# EAGLE design Serf_G2553 (EAGLE 6.5.0)
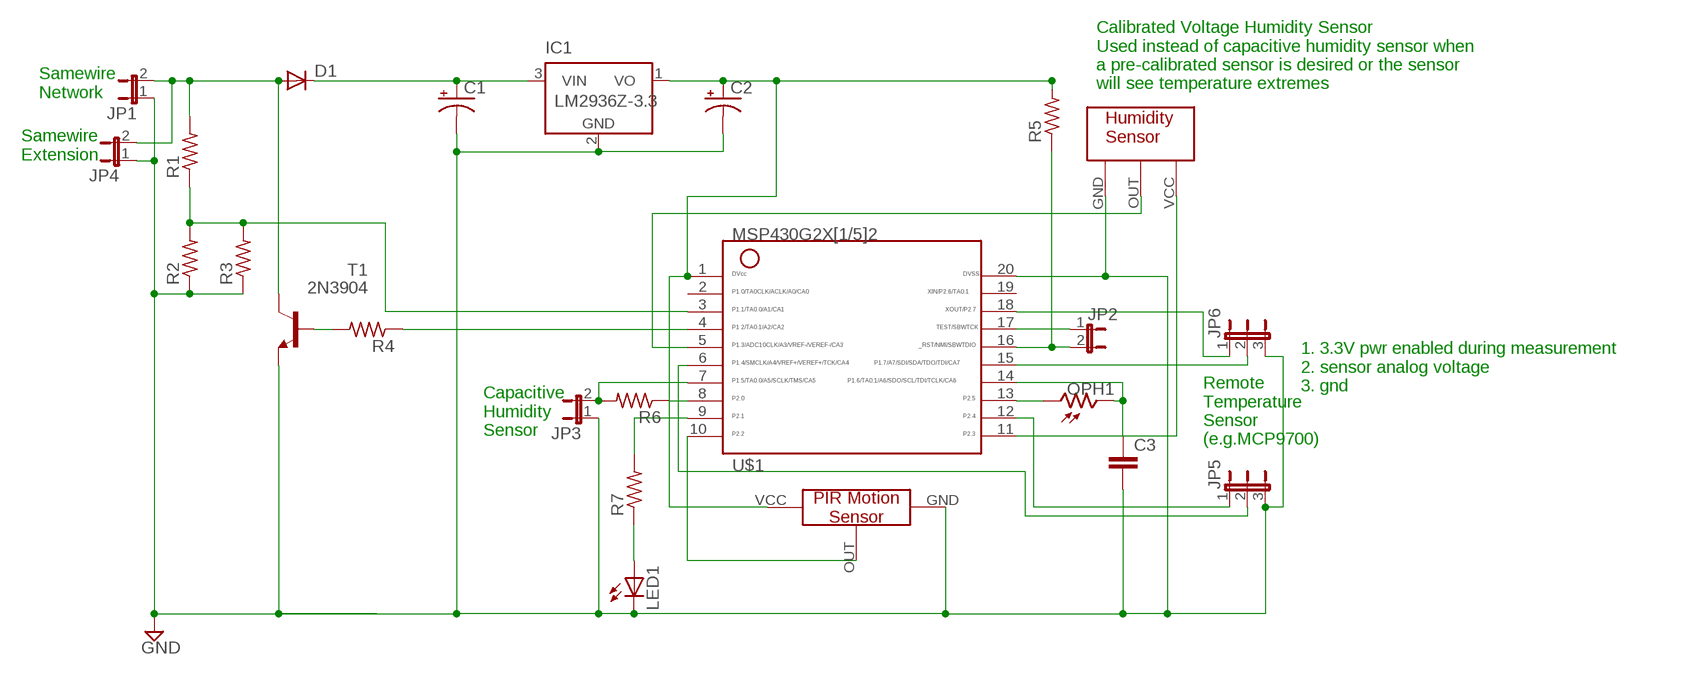
[diagram p0: schematic, sheet 1]

## Parts
C1  CPOL-USE2.5-6  [E2,5-6]
C2  CPOL-USE2.5-6  [E2,5-6]
C3  C7.5/3  [C7.5B3]
D1  1N4148DO35-7  [DO35-7]
IC1  LM2936Z-3.3  [TO92]
JP1  JP1E  [JP1]
JP2  JP1E  [JP1]
JP3  JP1E  [JP1]
JP4  JP1E  [JP1]
JP5  JP2E  [JP2]
JP6  JP2E  [JP2]
LED1  LED3MM  [LED3MM]
OPH1  VT90N1  [VT900]
R1  R-US_0204/2V  [0204V]
R2  R-US_0204/2V  [0204V]
R3  R-US_0204/2V  [0204V]
R4  R-US_0204/2V  [0204V]
R5  R-US_0204/2V  [0204V]
R6  R-US_0204/2V  [0204V]
R7  R-US_0204/2V  [0204V]
T1  2N3904  [TO92]
U$1  G2X[1/5]2---N20  [N20]
U$2  PANASONIC_PIR  [PANASONIC_PIR]
U$3  HIH-5030  [HIH-530]

## Nets
GND: C1.- C2.- C3.2 IC1.2(GND) JP1.1 JP3.1 JP4.1 JP5.3 JP6.3 LED1.K(C) R2.1 R3.1 T1.3(E) U$1.20 U$2.GND U$3.GND
N$1 [Samewire]: D1.A JP1.2 JP4.2 R1.2 T1.1(C)
N$2: OPH1.1 U$1.13
N$3: R4.1 U$1.4
N$4: R1.1 R2.2 R3.2 U$1.3
N$5: C3.1 OPH1.2 U$1.14
N$6: R4.2 T1.2(B)
N$7: R6.1 U$1.8
N$8: LED1.A R7.1
N$9: JP2.1 U$1.17
N$10: R7.2 U$1.9
N$11: JP3.2 R6.2 U$1.7
N$12: U$1.10 U$2.OUT
N$13: C1.+ D1.C IC1.3(VIN)
N$14: C2.+ IC1.1(VO) R5.2 U$1.1 U$2.VCC
N$15: U$1.5 U$3.OUT
N$16: U$1.11 U$3.VCC
N$18: JP5.1 U$1.12
N$19: JP5.2 U$1.6
N$20: JP2.2 R5.1 U$1.16
N$22: JP6.1 U$1.18
N$23: JP6.2 U$1.15
Unconnected: U$1.2 U$1.19

## Notes on the sheet
- Calibrated Voltage Humidity Sensor
  Used instead of capacitive humidity sensor when
  a pre-calibrated sensor is desired or the sensor
  will see temperature extremes
- Samewire
  Network
- Samewire
  Extension
- 1. 3.3V pwr enabled during measurement
  2. sensor analog voltage
  3. gnd
- Capacitive
  Humidity
  Sensor
- Remote
  Temperature
  Sensor
  (e.g.MCP9700)

## Library data of the parts
C1 C2 = rcl:CPOL-US: POLARIZED CAPACITOR, American symbol
C3 = capacitor-wima:C: CAPACITOR naming: grid - package width
D1 = diode:1N4148: DIODE high speed (Philips)
IC1 = national-semiconductor:LM2936?*: Ultra-Low Quiescent Current LDO Voltage Regulator Source: Data sheet <http://www.national.com/ds/LM/LM2936.pdf>; MF: NATIONAL SEMICONDUCTOR; MPN: LM2936Z-3.3/NOPB; OC_FARNELL: 1564641; OC_NEWARK: 41K4532
JP1-JP4 = jumper:JP1E: JUMPER
JP5 JP6 = jumper:JP2E: JUMPER
LED1 = led:LED: LED OSRAM: - CHIPLED LG R971, LG N971, LY N971, LG Q971, LY Q971, LO R971, LY R971 LH N974, LH R974 LS Q976, LO Q976, LY Q976 LO Q996 - Hyper CHIPLED LW Q18S LB Q993, LB Q99A, LB R99A - SideLED LS A670, LO A670, LY A670, LG A670, LP A670 LB A673, LV A673, LT A673, LW A673 LH A674 LY A675 LS A676, LA A676, LO A676, LY A676, LW A676 LS A679, LY A679, LG A679 - Hyper Micro SIDELED® LS Y876, LA Y876, LO Y876, LY Y876 LT Y87S - SmartLED LW L88C, LW L88S LB L89C, LB L89S, LG L890 LS L89K, LO L89K, LY L89K LS L896, LA L896, LO L896, LY L896 - TOPLED LS T670, LO T670, LY T670, LG T670, LP T670 LSG T670, LSP T670, LSY T670, LOP T670, LYG T670 LG T671, LOG T671, LSG T671 LB T673, LV T673, LT T673, LW T673 LH T674 LS T676, LA T676, LO T676, LY T676, LB T676, LH T676, LSB T676, LW T676 LB T67C, LV T67C, LT T67C, LS T67K, LO T67K, LY T67K, LW E67C LS E67B, LA E67B, LO E67B, LY E67B, LB E67C, LV E67C, LT E67C LW T67C LS T679, LY T679, LG T679 LS T770, LO T770, LY T770, LG T770, LP T770 LB T773, LV T773, LT T773, LW T773 LH T774 LS E675, LA E675, LY E675, LS T675 LS T776, LA T776, LO T776, LY T776, LB T776 LHGB T686 LT T68C, LB T68C - Hyper Mini TOPLED® LB M676 - Mini TOPLED Santana® LG M470 LS M47K, LO M47K, LY M47K Source: http://www.osram.convergy.de LUXEON: - LUMILED® LXK2-PW12-R00, LXK2-PW12-S00, LXK2-PW14-U00, LXK2-PW14-V00 LXK2-PM12-R00, LXK2-PM12-S00, LXK2-PM14-U00 LXK2-PE12-Q00, LXK2-PE12-R00, LXK2-PE12-S00, LXK2-PE14-T00, LXK2-PE14-U00 LXK2-PB12-K00, LXK2-PB12-L00, LXK2-PB12-M00, LXK2-PB14-N00, LXK2-PB14-P00, LXK2-PB14-Q00 LXK2-PR12-L00, LXK2-PR12-M00, LXK2-PR14-Q00, LXK2-PR14-R00 LXK2-PD12-Q00, LXK2-PD12-R00, LXK2-PD12-S00 LXK2-PH12-R00, LXK2-PH12-S00 LXK2-PL12-P00, LXK2-PL12-Q00, LXK2-PL12-R00 Source: www.luxeon.com KINGBRIGHT: KA-3528ASYC Source: www.kingbright.com
OPH1 = photo-elements:VT9: Photoconductive Cell VT900 Series Source: http://optoelectronics.perkinelmer.com/content/Datasheets/DTS_vt900seriesdatasheet.pdf
R1-R7 = rcl:R-US_: RESISTOR, American symbol
T1 = transistor:2N3904: NPN TRANSISTOR
U$1 = TI_MSP430_v16:G2X[1/5]2---N20: MSP430G2X[1/5]2 MSP430G2x52, MSP430G2x12 PDIP (N) 20 Pin Package http://focus.ti.com/docs/prod/folders/print/msp430g2452.html
U$2 = Panasonic_PIR:PANASONIC_PIR: Panasonic PIR Motion Sensor (EKMC1603111)
U$3 = honeywell_humidity_hih-5030:HIH-5030: Honeywell Humidity Sensor HIH-5030

## Net classes
1 Samewire: width 0.508 mm

## Board
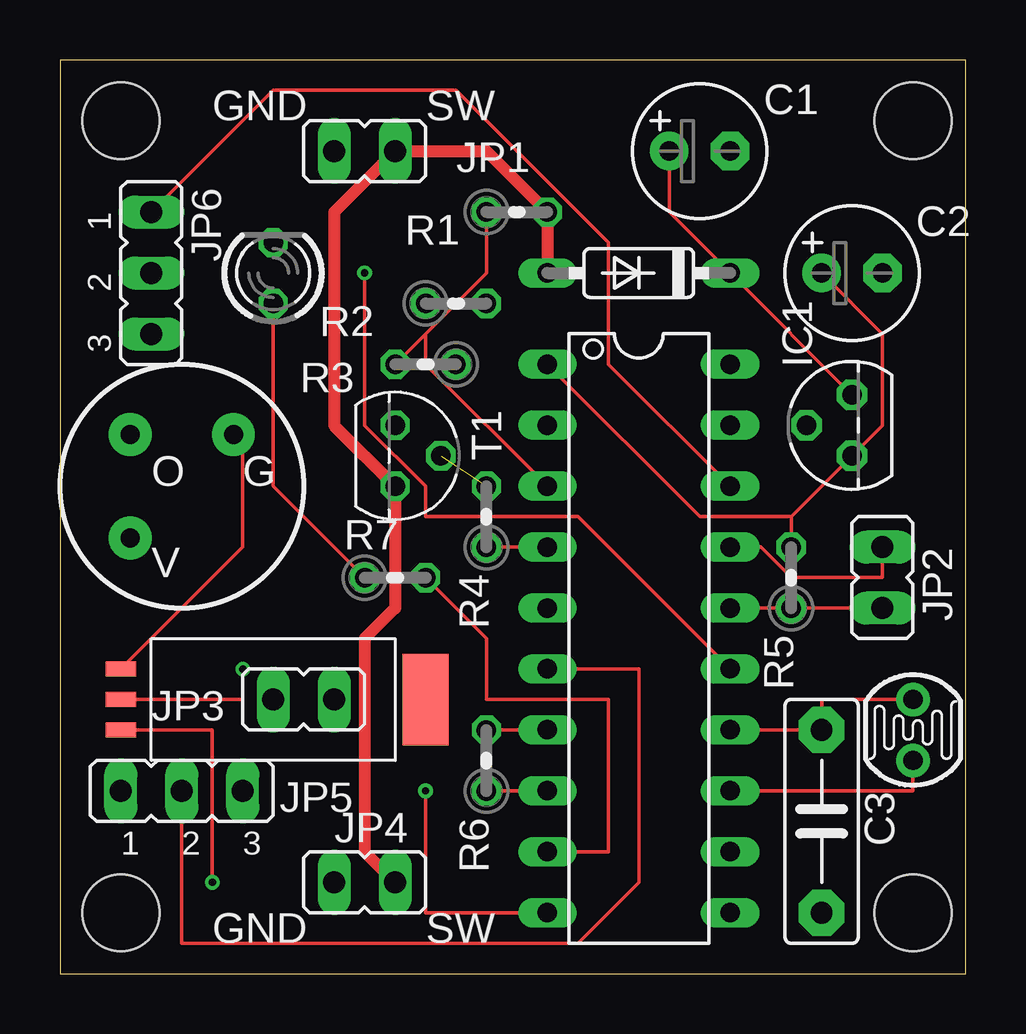
[diagram p1: board, top side]
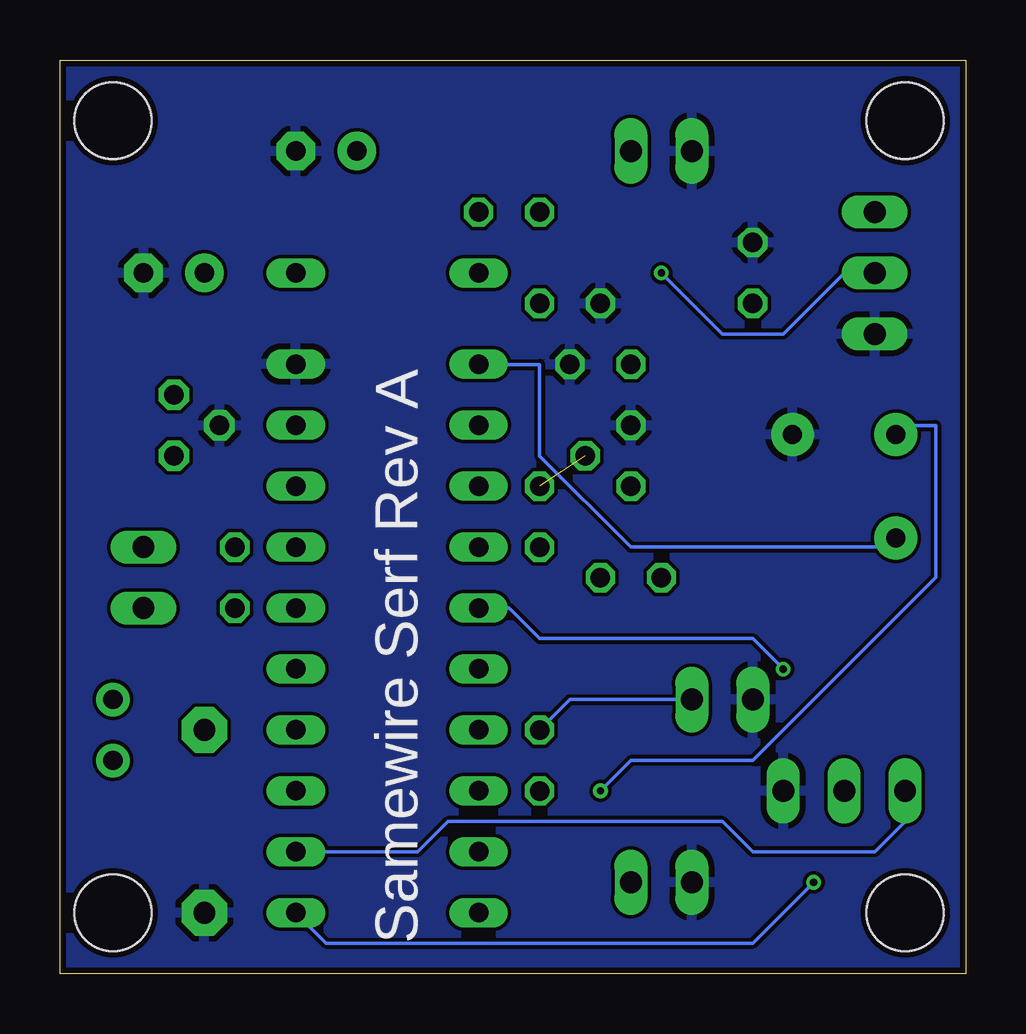
[diagram p2: board, bottom side, seen from below]

Size 37.77 x 38.09 mm. Coordinates in mm from the lower left corner, seen from the top.
Outline: 0,0 37.77,0 37.77,38.09 0,38.09 0,0
Copper layers (1*16): Top 0.035mm / dielectric 0.2mm / Bottom 0.035mm
Design rules "SeeedStudio_DRU_no_angle_20130527 *": minimum track width 6mil, minimum drill 12mil, track to track 6mil, track to pad 6mil, pad to pad 6mil, via to via 6mil, smd to smd 0mil, copper to edge 10mil, drill to drill 10mil, minimum pad ring 6mil, minimum via ring 6mil, stop-mask expansion 2mil, vias tented up to drill 25mil, thermal gap 10mil
Holes 3.2 mm at 35.56,35.56 2.54,2.54 2.54,35.56 35.56,2.54

### Footprints (pad centres in the part's own frame; a part is rotated, then mirrored left to right if it is on the bottom)
E2,5-6 = drill 0.813 pad 1.6: + -1.27,0 | drill 0.813 pad 1.6 octagon: - 1.27,0
C7.5B3 = drill 0.914 pad 1.905 octagon: 1 -3.81,0; 2 3.81,0
DO35-7 = drill 0.813 long: A 3.81,0; C -3.81,0
TO92 = drill 0.813 pad 1.27 octagon: 1 -1.27,0; 2 0,1.905; 3 1.27,0
JP1 = drill 0.914 long: 1 0,-1.27; 2 0,1.27
JP2 = drill 0.914 long: 1 -2.54,0; 2 0,0; 3 2.54,0
LED3MM = drill 0.813 octagon: A -1.27,0; K 1.27,0
VT900 = drill 0.8 pad 1.4: 1 -1.27,0; 2 1.27,0
0204V = drill 0.813 octagon: 1 -1.27,0; 2 1.27,0
TO92' = drill 0.813 octagon: 1 1.27,0; 2 0,1.905; 3 -1.27,0
N20 = drill 0.813 long: 1 -11.435,-3.81; 2 -8.895,-3.81; 3 -6.355,-3.81; 4 -3.815,-3.81; 5 -1.275,-3.81; 6 1.265,-3.81; 7 3.805,-3.81; 8 6.345,-3.81; 9 8.885,-3.81; 10 11.425,-3.81; 11 11.425,3.81; 12 8.885,3.81; 13 6.345,3.81; 14 3.805,3.81; 15 1.265,3.81; 16 -1.275,3.81; 17 -3.815,3.81; 18 -6.355,3.81; 19 -8.895,3.81; 20 -11.435,3.81
PANASONIC_PIR = drill 0.8 pad 1.778: GND 2.154,2.154; OUT -2.154,2.154; VCC -2.154,-2.154
HIH-530 = smd 0.635 x 1.27: GND -1.27,0; OUT 0,0; VCC 1.27,0 | smd 3.81 x 1.93: P$4 0,12.7

### Placement (x,y rotation side)
C1  26.67,34.29 0 top
C2  33.02,29.21 0 top
C3  31.75,6.35 270 top
D1  24.13,29.21 180 top
IC1  33.02,22.86 90 top
JP1  12.7,34.29 270 top
JP2  34.29,16.51 180 top
JP3  10.16,11.43 270 top
JP4  12.7,3.81 270 top
JP5  5.08,7.62 0 top
JP6  3.81,29.21 270 top
LED1  8.89,29.21 90 top
OPH1  35.56,10.16 90 top
R1  19.05,31.75 0 top
R2  16.51,27.94 0 top
R3  15.24,25.4 180 top
R4  17.78,19.05 90 top
R5  30.48,16.51 90 top
R6  17.78,8.89 90 top
R7  13.97,16.51 0 top
T1  2N3904  [TO92']  13.97,21.59 270 top
U$1  24.13,13.97 270 top
U$2  5.08,20.32 0 top
U$3  2.54,11.43 270 top

### Tracks (layer width: path | path; a pad name or v marks a point on that pad's centre or on a via)
GND
  Top 0.152: U$3.GND 7.62,17.78 7.62,22.86 U$2.GND
  pour Bottom: 0,0 0,38.1 38.1,38.1 38.1,0
N$1
  Top 0.508: D1.A R1.2 17.78,34.29 JP1.2 11.43,31.75 11.43,22.86 T1.1 13.97,15.24 12.7,13.97 12.7,5.08 JP4.2
N$2
  Top 0.152: OPH1.1 35.56,7.62 U$1.13
N$3
  Top 0.152: R4.1 U$1.4
N$4
  Top 0.152: 16.51,27.94 17.78,29.21 R1.1 | 16.51,27.94 15.24,26.67 | 15.24,26.67 R3.2 | 16.51,27.94 R2.2 | 15.24,26.67 15.24,25.4 U$1.3
N$5
  Top 0.152: U$1.14 C3.1 31.75,11.43 OPH1.2
N$6  (1 unrouted)
N$7
  Top 0.152: R6.1 U$1.8
N$8
  Top 0.152: R7.1 8.89,20.32 LED1.A
N$9
  Top 0.152: JP2.1 34.29,16.51 30.48,16.51 29.21,17.78 U$1.17
N$10
  Top 0.152: R7.2 16.51,15.24 17.78,13.97 17.78,11.43 22.86,11.43 22.86,5.08 U$1.9
N$11
  Top 0.152: R6.2 U$1.7
  Bottom 0.152: JP3.2 16.51,11.43 R6.2
N$12  (via drill 0.3)
  Top 0.152: v15.24,7.62 15.24,2.54 U$1.10
  Bottom 0.152: v15.24,7.62 13.97,8.89 8.89,8.89 1.27,16.51 1.27,22.86 2.54,22.86 U$2.OUT
N$13
  Top 0.152: C1.+ 25.4,31.75 D1.C IC1.3
N$14
  Top 0.152: 30.48,19.05 26.67,19.05 U$1.1 | R5.2 30.48,19.05 | 30.48,19.05 IC1.1 34.29,22.86 34.29,26.67 C2.+
  Bottom 0.152: U$2.VCC 2.54,17.78 13.97,17.78 17.78,21.59 17.78,25.4 U$1.1
N$15  (via drill 0.3)
  Top 0.152: U$3.OUT 7.62,11.43 v7.62,12.7
  Bottom 0.152: v7.62,12.7 8.89,13.97 17.78,13.97 19.05,15.24 U$1.5
N$16  (via drill 0.3)
  Top 0.152: U$3.VCC 6.35,10.16 v6.35,3.81
  Bottom 0.152: v6.35,3.81 8.89,1.27 26.67,1.27 U$1.11
N$18
  Bottom 0.152: JP5.1 2.54,6.35 3.81,5.08 8.89,5.08 10.16,6.35 21.59,6.35 22.86,5.08 U$1.12
N$19
  Top 0.152: JP5.2 5.08,1.27 21.59,1.27 24.13,3.81 24.13,12.7 U$1.6
N$20
  Top 0.152: U$1.16 R5.1 JP2.2
N$22
  Top 0.152: JP6.1 8.89,36.83 16.51,36.83 22.86,30.48 22.86,25.4 U$1.18
N$23  (via drill 0.3)
  Top 0.152: v12.7,29.21 12.7,22.86 15.24,20.32 15.24,19.05 21.59,19.05 U$1.15
  Bottom 0.152: v12.7,29.21 10.16,26.67 7.62,26.67 5.08,29.21 JP6.2

### Text on the board
tPlace: GND | SW | GND | SW
bPlace: Samewire Serf Rev A